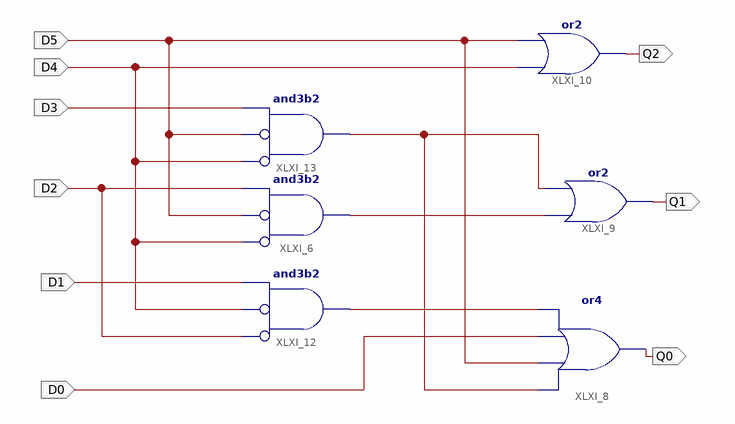
[diagram p0: schematic sheet 1]
// Xilinx ISE schematic Schem1.sch (virtex5) as structural Verilog: 6 symbols, 9 ports
module Schem1 (
  input  D3,
  input  D1,
  input  D5,
  input  D4,
  input  D2,
  input  D0,
  output Q2,
  output Q0,
  output Q1
);

  wire XLXN_10, XLXN_33, XLXN_34;

  and XLXI_6 (XLXN_33, ~D4, ~D5, D2);  // and3b2
  or XLXI_8 (Q0, XLXN_34, D5, D0, XLXN_10);
  or XLXI_10 (Q2, D4, D5);
  or XLXI_9 (Q1, XLXN_33, XLXN_34);
  and XLXI_12 (XLXN_10, ~D2, ~D4, D1);  // and3b2
  and XLXI_13 (XLXN_34, ~D4, ~D5, D3);  // and3b2
endmodule
